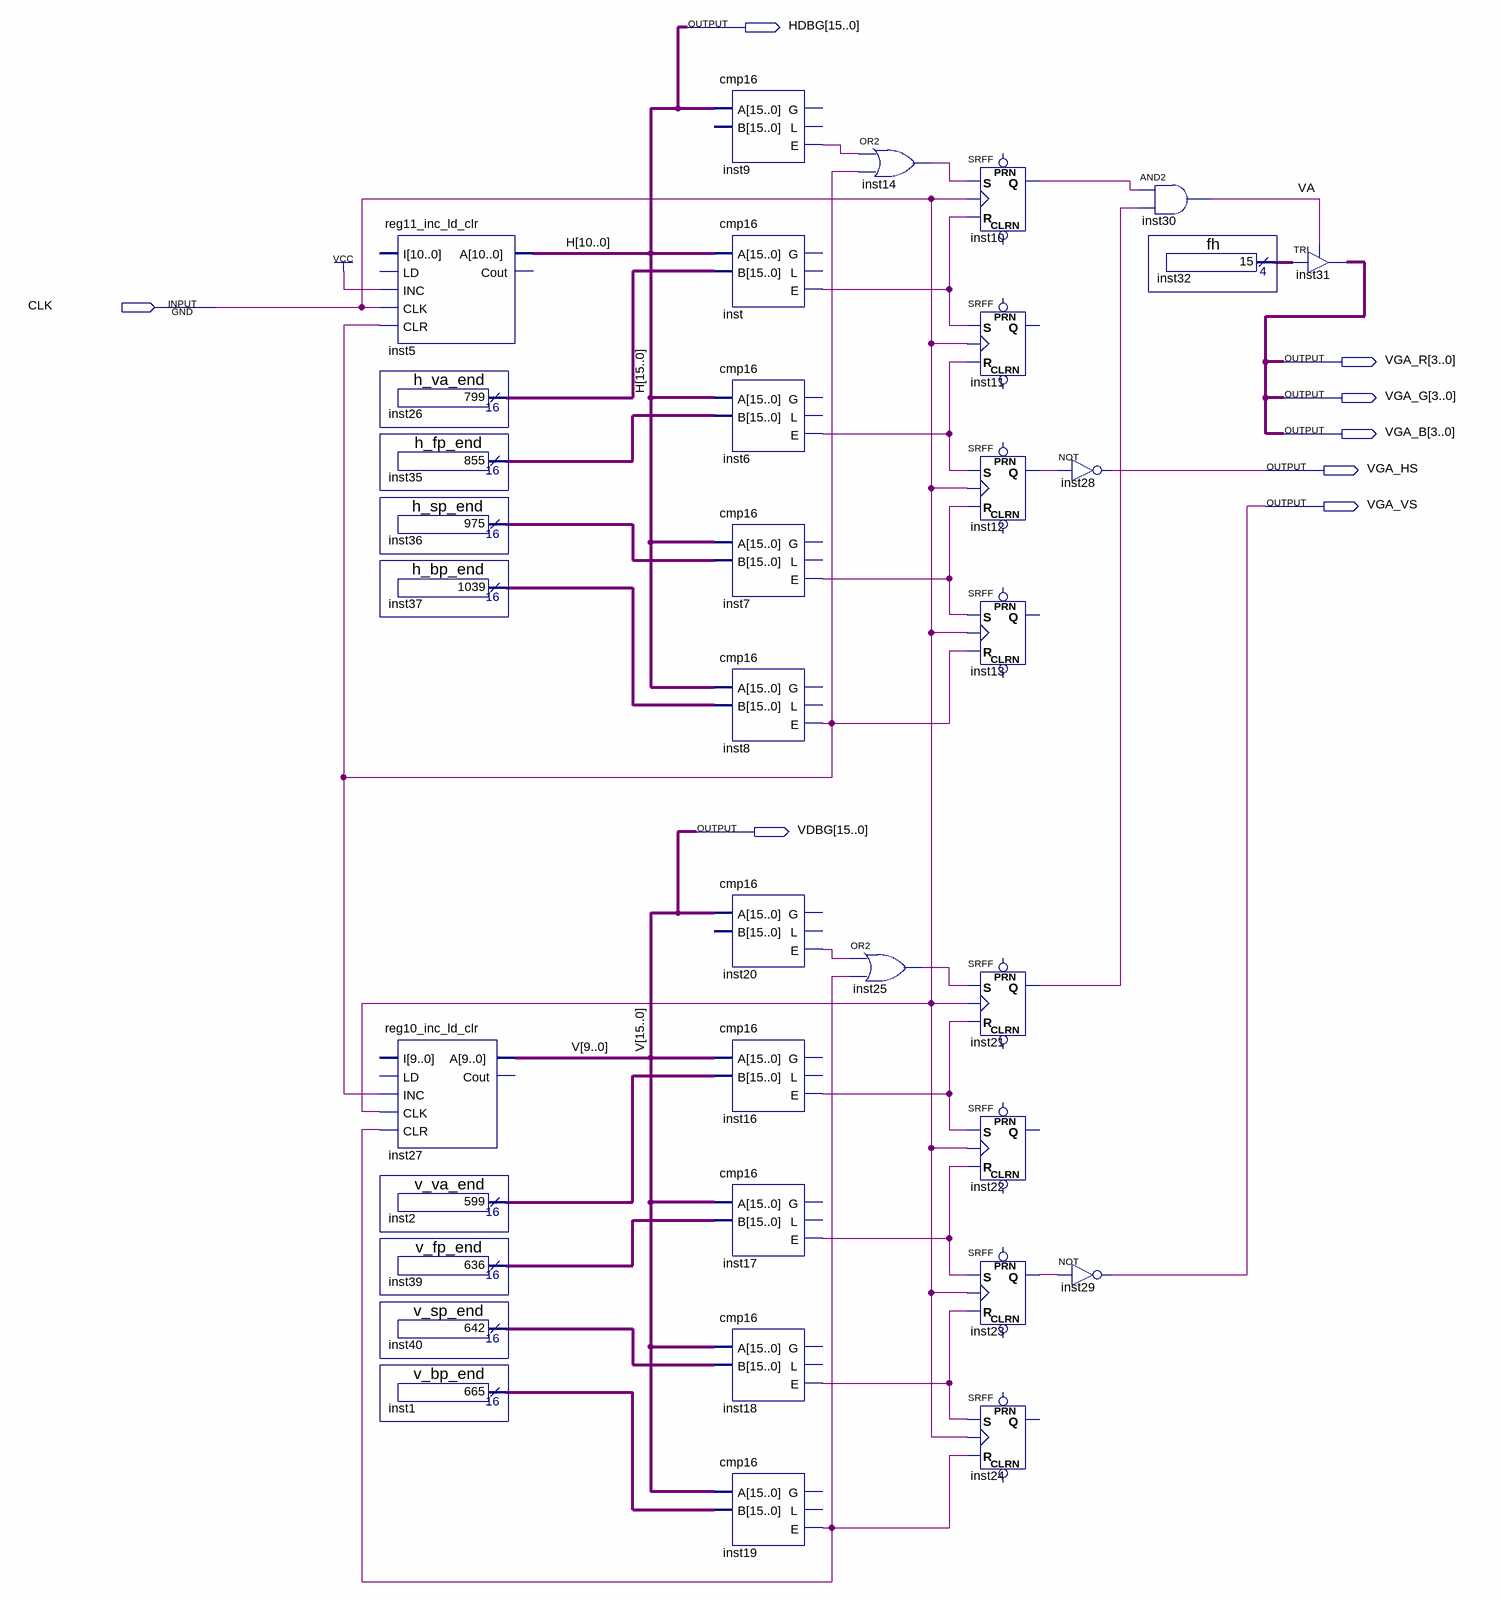
[diagram p0: schematic sheet]
// Quartus schematic ramdac.bdf as structural Verilog: 35 symbols, 8 pins
module ramdac (
  input  CLK,
  output [15:0] HDBG,
  output [3:0] VGA_R,
  output [3:0] VGA_G,
  output [3:0] VGA_B,
  output VGA_HS,
  output VGA_VS,
  output [15:0] VDBG
);

  wire inst6_e, inst7_e, inst8_e, inst9_e, inst10_q, inst12_q, inst14_out, inst16_e, inst17_e, inst18_e,
       inst19_e, inst20_e, inst21_q, inst23_q, inst25_out, inst_e, VA;
  wire [3:0] inst32_result;
  wire [15:0] inst1_result, inst2_result, inst26_result, inst35_result, inst36_result, inst37_result,
       inst39_result, inst40_result;

  reg11_inc_ld_clr inst5 (.INC(1'b1), .CLK(CLK), .CLR(inst8_e), .A(HDBG[10:0]));  // open: I, LD, Cout
  h_va_end inst26 (.result(inst26_result));
  h_fp_end inst35 (.result(inst35_result));
  h_sp_end inst36 (.result(inst36_result));
  h_bp_end inst37 (.result(inst37_result));
  reg10_inc_ld_clr inst27 (.INC(inst8_e), .CLK(CLK), .CLR(inst19_e), .A(VDBG[9:0]));  // open: I, LD, Cout
  v_va_end inst2 (.result(inst2_result));
  v_fp_end inst39 (.result(inst39_result));
  v_sp_end inst40 (.result(inst40_result));
  v_bp_end inst1 (.result(inst1_result));
  cmp16 inst9 (.A(HDBG), .E(inst9_e));  // open: B, G, L
  cmp16 inst (.A(HDBG), .B(inst26_result), .E(inst_e));  // open: G, L
  cmp16 inst6 (.A(HDBG), .B(inst35_result), .E(inst6_e));  // open: G, L
  cmp16 inst7 (.A(HDBG), .B(inst36_result), .E(inst7_e));  // open: G, L
  cmp16 inst8 (.A(HDBG), .B(inst37_result), .E(inst8_e));  // open: G, L
  cmp16 inst20 (.A(VDBG), .E(inst20_e));  // open: B, G, L
  cmp16 inst16 (.A(VDBG), .B(inst2_result), .E(inst16_e));  // open: G, L
  cmp16 inst17 (.A(VDBG), .B(inst39_result), .E(inst17_e));  // open: G, L
  cmp16 inst18 (.A(VDBG), .B(inst40_result), .E(inst18_e));  // open: G, L
  cmp16 inst19 (.A(VDBG), .B(inst1_result), .E(inst19_e));  // open: G, L
  or inst14 (inst14_out, inst9_e, inst8_e);
  or inst25 (inst25_out, inst20_e, inst19_e);
  SRFF inst10 (.S(inst14_out), .R(inst_e), .CLK(CLK), .Q(inst10_q));  // open: PRN, CLRN
  SRFF inst11 (.S(inst_e), .R(inst6_e), .CLK(CLK));  // open: PRN, CLRN, Q
  SRFF inst12 (.S(inst6_e), .R(inst7_e), .CLK(CLK), .Q(inst12_q));  // open: PRN, CLRN
  SRFF inst13 (.S(inst7_e), .R(inst8_e), .CLK(CLK));  // open: PRN, CLRN, Q
  SRFF inst21 (.S(inst25_out), .R(inst16_e), .CLK(CLK), .Q(inst21_q));  // open: PRN, CLRN
  SRFF inst22 (.S(inst16_e), .R(inst17_e), .CLK(CLK));  // open: PRN, CLRN, Q
  SRFF inst23 (.S(inst17_e), .R(inst18_e), .CLK(CLK), .Q(inst23_q));  // open: PRN, CLRN
  SRFF inst24 (.S(inst18_e), .R(inst19_e), .CLK(CLK));  // open: PRN, CLRN, Q
  not inst28 (VGA_HS, inst12_q);
  not inst29 (VGA_VS, inst23_q);
  and inst30 (VA, inst10_q, inst21_q);
  fh inst32 (.result(inst32_result));
  TRI inst31[3:0] (.IN(inst32_result), .OE(VA), .OUT(VGA_B));

  assign VGA_G = VGA_B;
  assign VGA_R = VGA_B;

  // Other names for the same wires on the sheet: H[15:0] = HDBG; V[15:0] = VDBG
endmodule
